# EasyEDA Pro project nrf24l01.eprj

# Schematic nRF24L01
Create Date: 2024-01-03; Page Name: P1; Project Name: nrf24l01; Schematic Name: nRF24L01; Update Date: 2024-01-03; Company: 嘉立创EDA; Page Size: A4; Version: V1.0
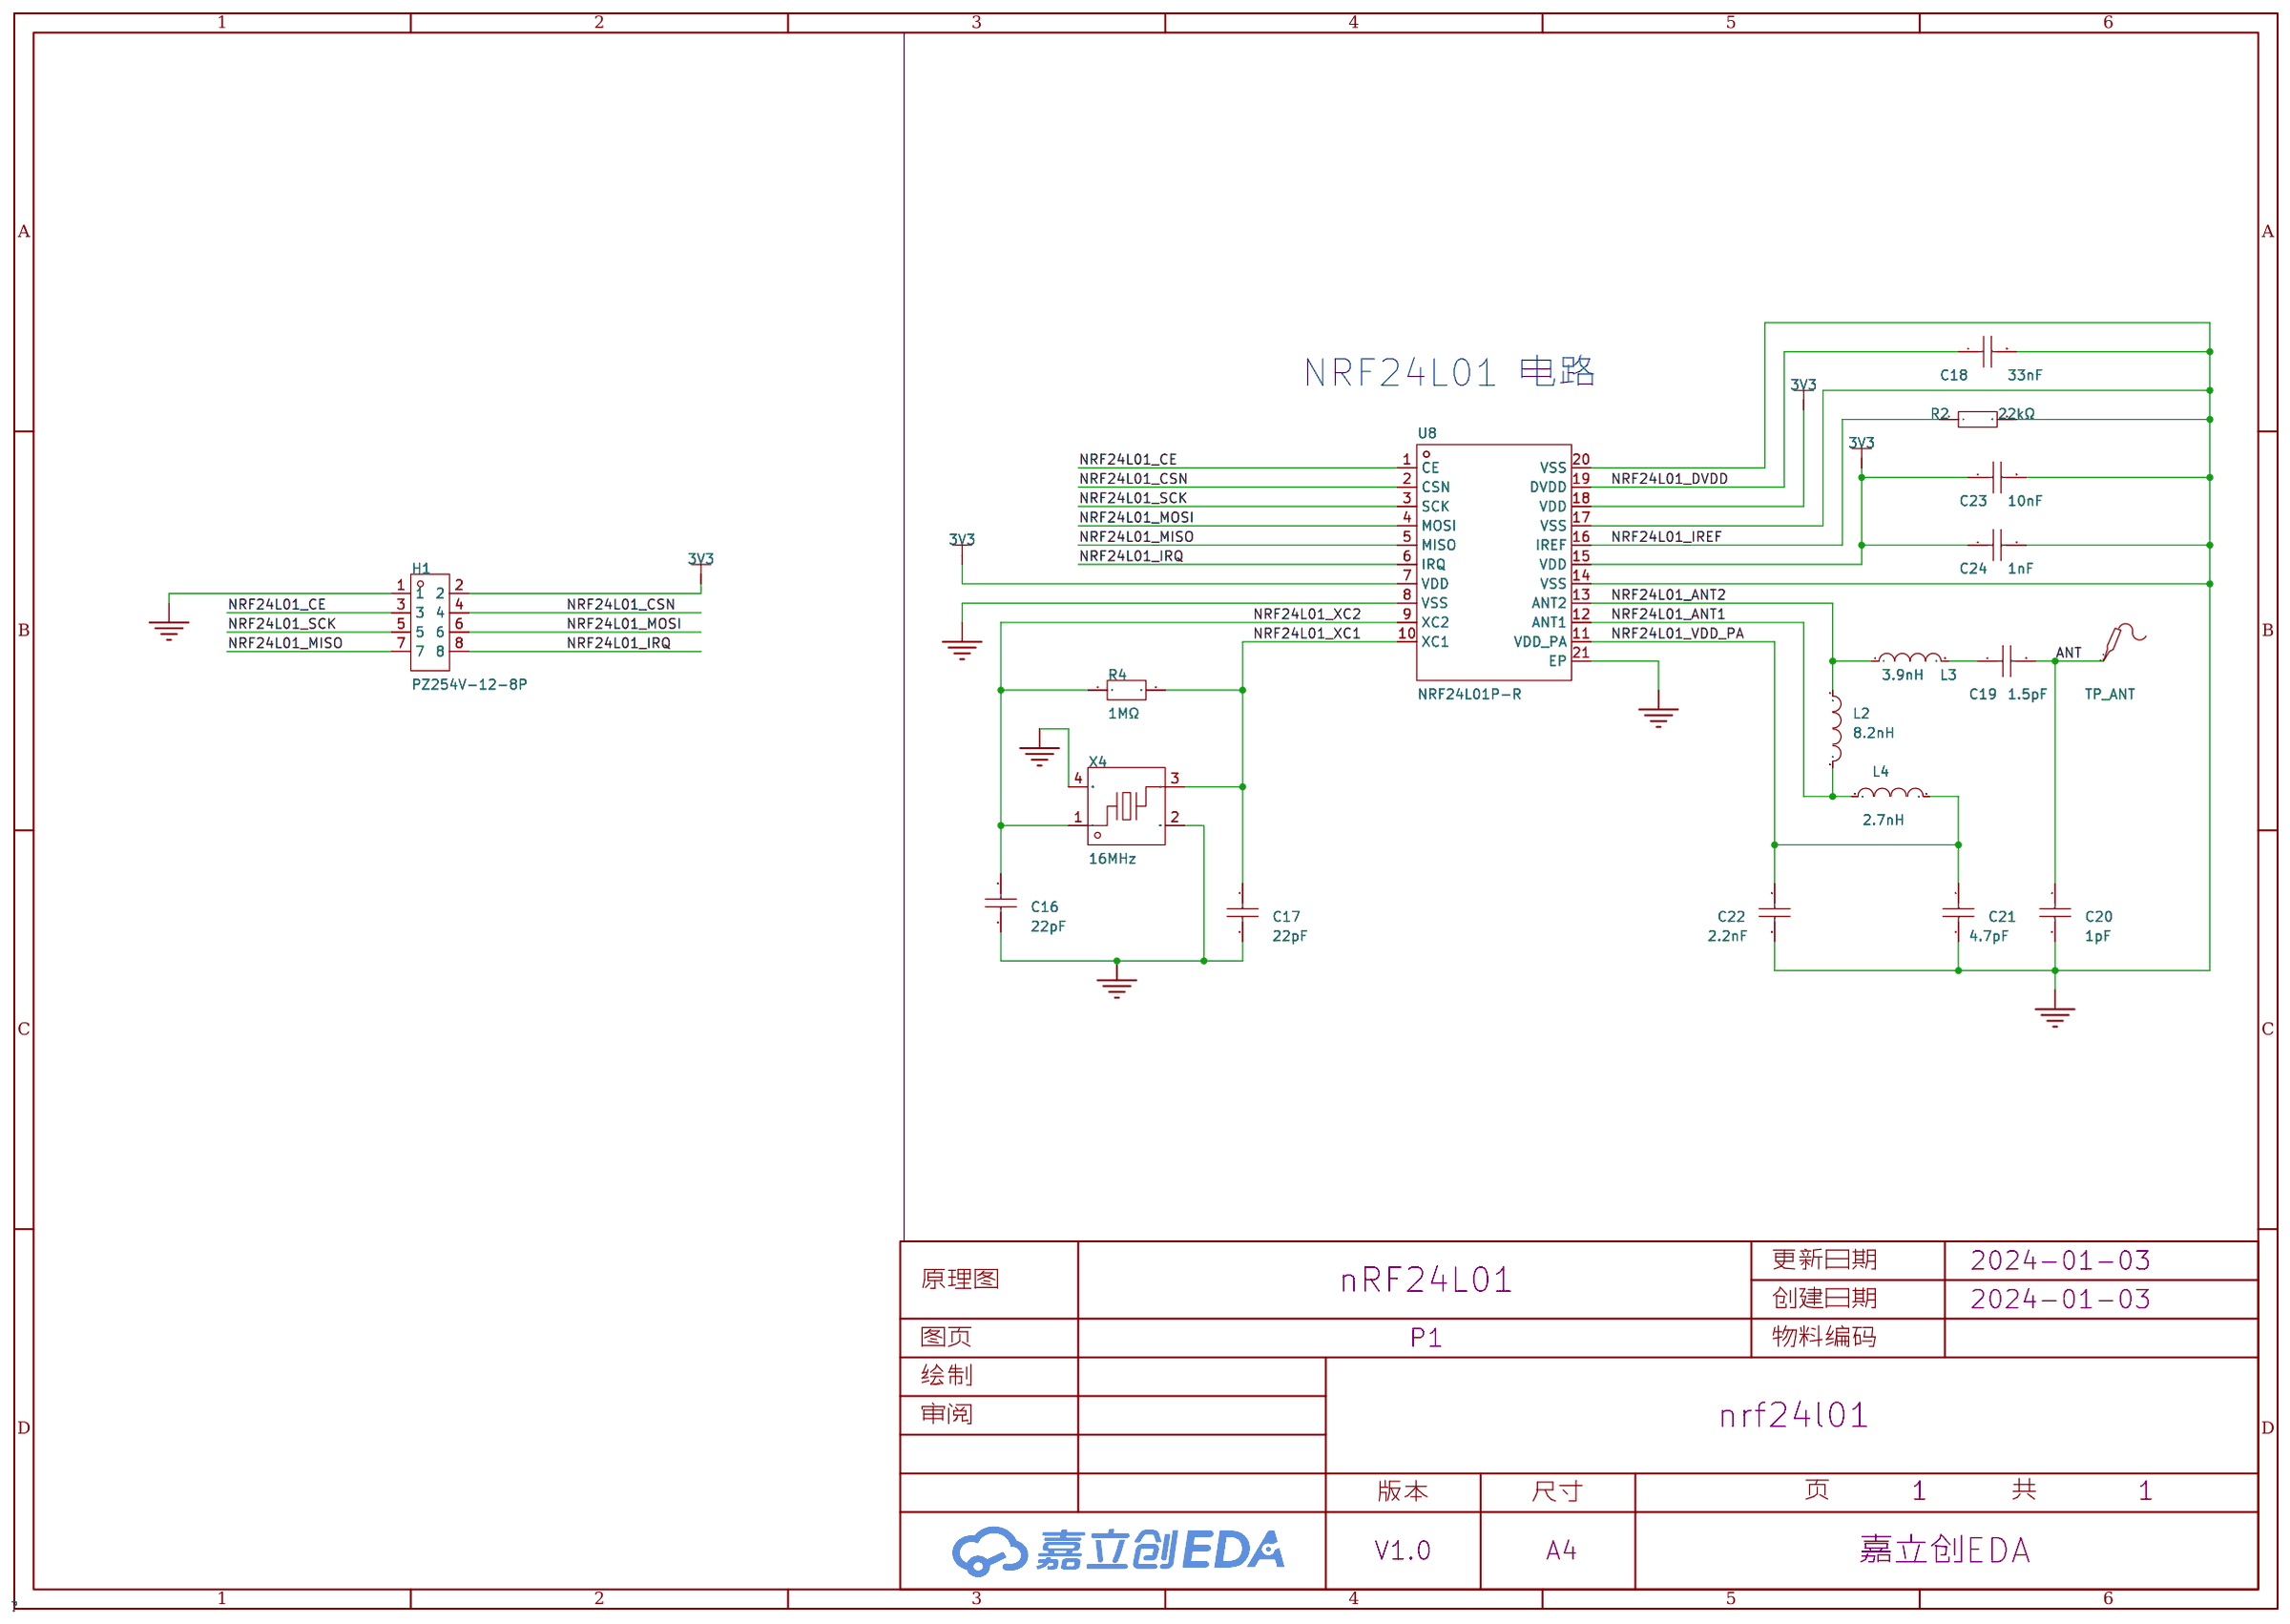
[diagram p0: schematic sheet]

## Parts
C16  22pF  [C0603]
C17  22pF  [C0603]
C18  33nF  [C0603]
C19  1.5pF  [C0603]
C20  1pF  [C0603]
C21  4.7pF  [C0603]
C22  2.2nF  [C0603]
C23  10nF  [C0603]
C24  1nF  [C0603]
H1  PZ254V-12-8P  [HDR-TH_8P-P2.54-V-M-R2-C4-S2.54]
L2  8.2nH  [L0603]
L3  3.9nH  [IND-SMD_L1.6-W0.8-1]
L4  2.7nH  [L0603]
R2  22kΩ  [R0603]
R4  1MΩ  [R0603]
TP_ANT  -  [Test-Point-0.5mm]
U8  NRF24L01P-R  [QFN-20_L4.0-W4.0-P0.50-BL-EP]
X4  16MHz  [CRYSTAL-SMD_4P-L2.0-W1.6-BL]

## Library data of the parts
C16 C17 = CC0603JRNPO9BN220: 容值:22pF;精度:±5%;额定电压:50V;材质(温度系数):NP0;; LCSC Part Name: 22pF ±5% 50V; Supplier Part: C105620; Manufacturer: YAGEO(国巨); Supplier Footprint: 0603; JLCPCB Part Class: 扩展库; Datasheet: https://atta.szlcsc.com/upload/public/pdf/source/20170505/1493957838062.pdf; Supplier: LCSC; Tolerance: ±5%; Voltage Rated: 50V; Temperature Coefficient: NP0
C18 = CL10B333KB8NNNC: 容值:33nF;精度:±10%;额定电压:50V;材质(温度系数):X7R;; LCSC Part Name: 33nF ±10% 50V; Supplier Part: C21117; Manufacturer: SAMSUNG(三星); Supplier Footprint: 0603; JLCPCB Part Class: 基础库; Datasheet: https://atta.szlcsc.com/upload/public/pdf/source/20160218/1457707763339.pdf; Supplier: LCSC; Tolerance: ±10%; Voltage Rated: 50V; Temperature Coefficient: X7R
C19 = 0603CG1R5C500NT: 容值:1.5pF;额定电压:50V;材质(温度系数):C0G;; LCSC Part Name: 1.5pF 50V; Supplier Part: C1639; Manufacturer: FH(风华); Supplier Footprint: 0603; JLCPCB Part Class: 扩展库; Datasheet: https://atta.szlcsc.com/upload/public/pdf/source/20200305/C486355_26A10D38EF8C2A5C37091D0039909270.pdf; Supplier: LCSC; Voltage Rated: 50V; Temperature Coefficient: C0G
C20 = 0603CG1R0C500NT: 容值:1pF;额定电压:50V;材质(温度系数):C0G;; LCSC Part Name: 1pF 50V; Supplier Part: C37117; Manufacturer: FH(风华); Supplier Footprint: 0603; JLCPCB Part Class: 扩展库; Datasheet: https://atta.szlcsc.com/upload/public/pdf/source/20200305/C486355_26A10D38EF8C2A5C37091D0039909270.pdf; Supplier: LCSC; Voltage Rated: 50V; Temperature Coefficient: C0G
C21 = 0603CG4R7C500NT: 容值:4.7pF;额定电压:50V;材质(温度系数):C0G;; LCSC Part Name: 4.7pF 50V; Supplier Part: C1669; Manufacturer: FH(风华); Supplier Footprint: 0603; JLCPCB Part Class: 扩展库; Datasheet: https://atta.szlcsc.com/upload/public/pdf/source/20200305/C486355_26A10D38EF8C2A5C37091D0039909270.pdf; Supplier: LCSC; Voltage Rated: 50V; Temperature Coefficient: C0G
C22 = 0603B222K500NT: 容值:2.2nF;精度:±10%;额定电压:50V;材质(温度系数):X7R;; LCSC Part Name: 2.2nF ±10% 50V; Supplier Part: C1604; Manufacturer: FH(风华); Supplier Footprint: 0603; JLCPCB Part Class: 基础库; Datasheet: https://atta.szlcsc.com/upload/public/pdf/source/20200305/C486355_26A10D38EF8C2A5C37091D0039909270.pdf; Supplier: LCSC; Tolerance: ±10%; Voltage Rated: 50V; Temperature Coefficient: X7R
C23 = CC0603KRX7R9BB103: 容值:10nF;精度:±10%;额定电压:50V;材质(温度系数):X7R;; LCSC Part Name: 10nF ±10% 50V; Supplier Part: C100042; Manufacturer: YAGEO(国巨); Supplier Footprint: 0603; JLCPCB Part Class: 扩展库; Datasheet: https://atta.szlcsc.com/upload/public/pdf/source/20181008/C309510_22F155564471FAF6A489F7D68F34234E.pdf; Supplier: LCSC; Tolerance: ±10%; Voltage Rated: 50V; Temperature Coefficient: X7R
C24 = CC0603KRX7R9BB102: 容值:1nF;精度:±10%;额定电压:50V;材质(温度系数):X7R;; LCSC Part Name: 1nF ±10% 50V; Supplier Part: C100040; Manufacturer: YAGEO(国巨); Supplier Footprint: 0603; JLCPCB Part Class: 扩展库; Datasheet: https://atta.szlcsc.com/upload/public/pdf/source/20180910/C282072_33301C7F631E79921B82A8DAC6BCC5B3.pdf; Supplier: LCSC; Tolerance: ±10%; Voltage Rated: 50V; Temperature Coefficient: X7R
H1 = PZ254V-12-8P: 插针结构:2x4P;间距:2.54mm;行距:2.54mm;圆针/方针:方针;安装类型:直插;排数:双排;总PIN位数:8P;额定电流:-;额定电压:-;配合针长度:6mm;塑高:2.5mm;端接针长度:3mm;触头材质:黄铜;触头镀层:-;工作温度范围:-40℃~+105℃;颜色:黑色;; LCSC Part Name: 间距:2.54mm 2x4P 直插 方针; Supplier Part: C492421; Manufacturer: XFCN(兴飞); Supplier Footprint: 插件,P=2.54mm; JLCPCB Part Class: 扩展库; Datasheet: https://atta.szlcsc.com/upload/public/pdf/source/20200309/C492421_DC8A206AF99CD7755BD4A5B0BC48200B.pdf; Supplier: LCSC; Pin Structure: 2x4P; Pitch: 2.54mm; Row Spacing: 2.54mm; Circluar Pins/Square Pins: 方针; Mounting Type: 直插; Number of Rows: 双排; Number of Pins: 8P; Length of Mating Pin: 6mm; Insulation Height: 2.5mm; Length of End Connection Pin: 3mm; Contact Material: 黄铜; Operating Temperature Range: -40℃~+105℃; Color: 黑色
L2 = VHF160808H8N2JT: 电感值:8.2nH;精度:±5%;额定电流:400mA;饱和电流(Isat):-;直流电阻(DCR):350mΩ;; LCSC Part Name: 8.2nH ±5%; Supplier Part: C90204; Manufacturer: FH(风华); Supplier Footprint: 0603; JLCPCB Part Class: 扩展库; Datasheet: https://atta.szlcsc.com/upload/public/pdf/source/20230223/8EF545BE87E825DABED9AF3380ABCE94.pdf; Supplier: LCSC; Tolerance: ±5%; Rated Current: 400mA; DC Resistance (DCR): 350mΩ
L3 = LQW18AN3N9C10D: 电感值:3.9nH;额定电流:1A;饱和电流(Isat):-;; Supplier Part: C521237; Manufacturer: muRata(村田); Supplier Footprint: 0603; JLCPCB Part Class: 扩展库; Datasheet: https://atta.szlcsc.com/upload/public/pdf/source/20181211/C341790_D709A266A9D251194E0E402A9D974B33.pdf; Supplier: LCSC; Rated Current: 1A; DC Resistance (DCR): 32mΩ
L4 = SCC1608C2N7SSP: 电感值:2.7nH;额定电流:500mA;饱和电流(Isat):-;直流电阻(DCR):200mΩ;; Supplier Part: C412027; Manufacturer: Sunltech(韩国顺磁); Supplier Footprint: 0603; JLCPCB Part Class: 扩展库; Datasheet: https://atta.szlcsc.com/upload/public/pdf/source/20190819/C412052_7E47CA9107AD18C13168C896A90007C8.pdf; Supplier: LCSC; Rated Current: 500mA; DC Resistance (DCR): 200mΩ
R2 = 0603WAF2202T5E: 电阻类型:厚膜电阻;阻值:22kΩ;精度:±1%;功率:100mW;最大工作电压:75V;温度系数:±100ppm/℃;; LCSC Part Name: 22kΩ ±1% 100mW 厚膜电阻; Supplier Part: C31850; Manufacturer: UNI-ROYAL(厚声); Supplier Footprint: 0603; JLCPCB Part Class: 基础库; Datasheet: https://atta.szlcsc.com/upload/public/pdf/source/20200306/C422600_1E6D84923E4A46A82E41ADD87F860B5C.pdf; Supplier: LCSC; Type: 厚膜电阻; Tolerance: ±1%; Power(Watts): 100mW; Overload Voltage (Max): 75V; Temperature Coefficient: ±100ppm/℃; Operating Temperature Range: -55℃~+155℃
R4 = SC0603F1004F2BNRH: 阻值:1MΩ;精度:±1%;功率:-;温度系数:±100ppm/℃;; LCSC Part Name: 1MΩ ±1%; Supplier Part: C3152128; Manufacturer: Sunway(信维通信); Supplier Footprint: 0603; JLCPCB Part Class: 扩展库; Datasheet: https://atta.szlcsc.com/upload/public/pdf/source/20220728/FFCE43BB6DF8FA16AEE331F0F4B289DE.pdf; Supplier: LCSC; Tolerance: ±1%; Temperature Coefficient: ±100ppm/℃
TP_ANT = Test-Point: Test Point 测试点
U8 = NRF24L01P-R: 频率范围:2.4GHz;接口:SPI;应用领域:通用 ISM>1GHz;数据速率:2Mbps;灵敏度:-94dBm;典型应用频率:2.4GHz;; LCSC Part Name: 单芯片2.4GHz收发器; Supplier Part: C8791; Manufacturer: NORDIC; Supplier Footprint: QFN-20-EP(4x4); JLCPCB Part Class: 扩展库; Datasheet: https://atta.szlcsc.com/upload/public/pdf/source/20120816/1457706530106.pdf; Supplier: LCSC; Frequency Range: 2.4GHz; Interface: SPI; Operating Voltage: 1.9V~3.6V; Applications: 通用 ISM>1GHz; Output Power: 0dBm; Data Rate: 2Mbps; Current Of Transmitting: 7mA; Sensitivity: -94dBm; Receive Current: 12.6mA; Typical Application Frequency: 2.4GHz; Operating Temperature: -40℃~+85℃
X4 = XL7EL89COI-111YLC-16M: 晶振类型:贴片晶振;频率:16MHz;常温频差:±10ppm;外接负载电容:12pF;频率稳定度(全温):±20ppm;; LCSC Part Name: 16MHz ±10ppm 12pF; Supplier Part: C2965579; Manufacturer: YXC(扬兴晶振); Supplier Footprint: SMD2016-4P; JLCPCB Part Class: 扩展库; Datasheet: https://atta.szlcsc.com/upload/public/pdf/source/20220121/6B4B3E7EF7974858943D806BF8CACEA3.pdf; Supplier: LCSC; Crystal Type: 贴片晶振; Normal temperature Frequency Tolerance: ±10ppm; External load capacitor: 12pF; Frequency Stability(Full temperature range): ±20ppm; Operating Temperature: -40℃~+85℃

## Nets
3V3: C23.1 C24.1 H1.2 U8.7(VDD) U8.15(VDD) U8.18(VDD)
GND: C16.2 C17.2 C18.2 C20.2 C21.2 C22.2 C23.2 C24.2 H1.1 R2.2 U8.8(VSS) U8.14(VSS) U8.17(VSS) U8.20(VSS) U8.21(EP) X4.2(GND) X4.4(GND)
ANT: C19.2 C20.1 TP_ANT.1
NRF24L01_ANT1: L2.2 L4.1 U8.12(ANT1)
NRF24L01_ANT2: L2.1 L3.1 U8.13(ANT2)
NRF24L01_CE: H1.3 U8.1(CE)
NRF24L01_CSN: H1.4 U8.2(CSN)
NRF24L01_DVDD: C18.1 U8.19(DVDD)
NRF24L01_IREF: R2.1 U8.16(IREF)
NRF24L01_IRQ: H1.8 U8.6(IRQ)
NRF24L01_MISO: H1.7 U8.5(MISO)
NRF24L01_MOSI: H1.6 U8.4(MOSI)
NRF24L01_SCK: H1.5 U8.3(SCK)
NRF24L01_VDD_PA: C21.1 C22.1 L4.2 U8.11(VDD_PA)
NRF24L01_XC1: C17.1 R4.2 U8.10(XC1) X4.3
NRF24L01_XC2: C16.1 R4.1 U8.9(XC2) X4.1
$1N798: C19.1 L3.2

## Notes on the sheet
- NRF24L01 电路

# Schematic Ci24R1
Create Date: 2024-01-03; Page Name: P1; Project Name: nrf24l01; Schematic Name: Ci24R1; Update Date: 2024-01-03; Company: 嘉立创EDA; Page Size: A4; Version: V1.0
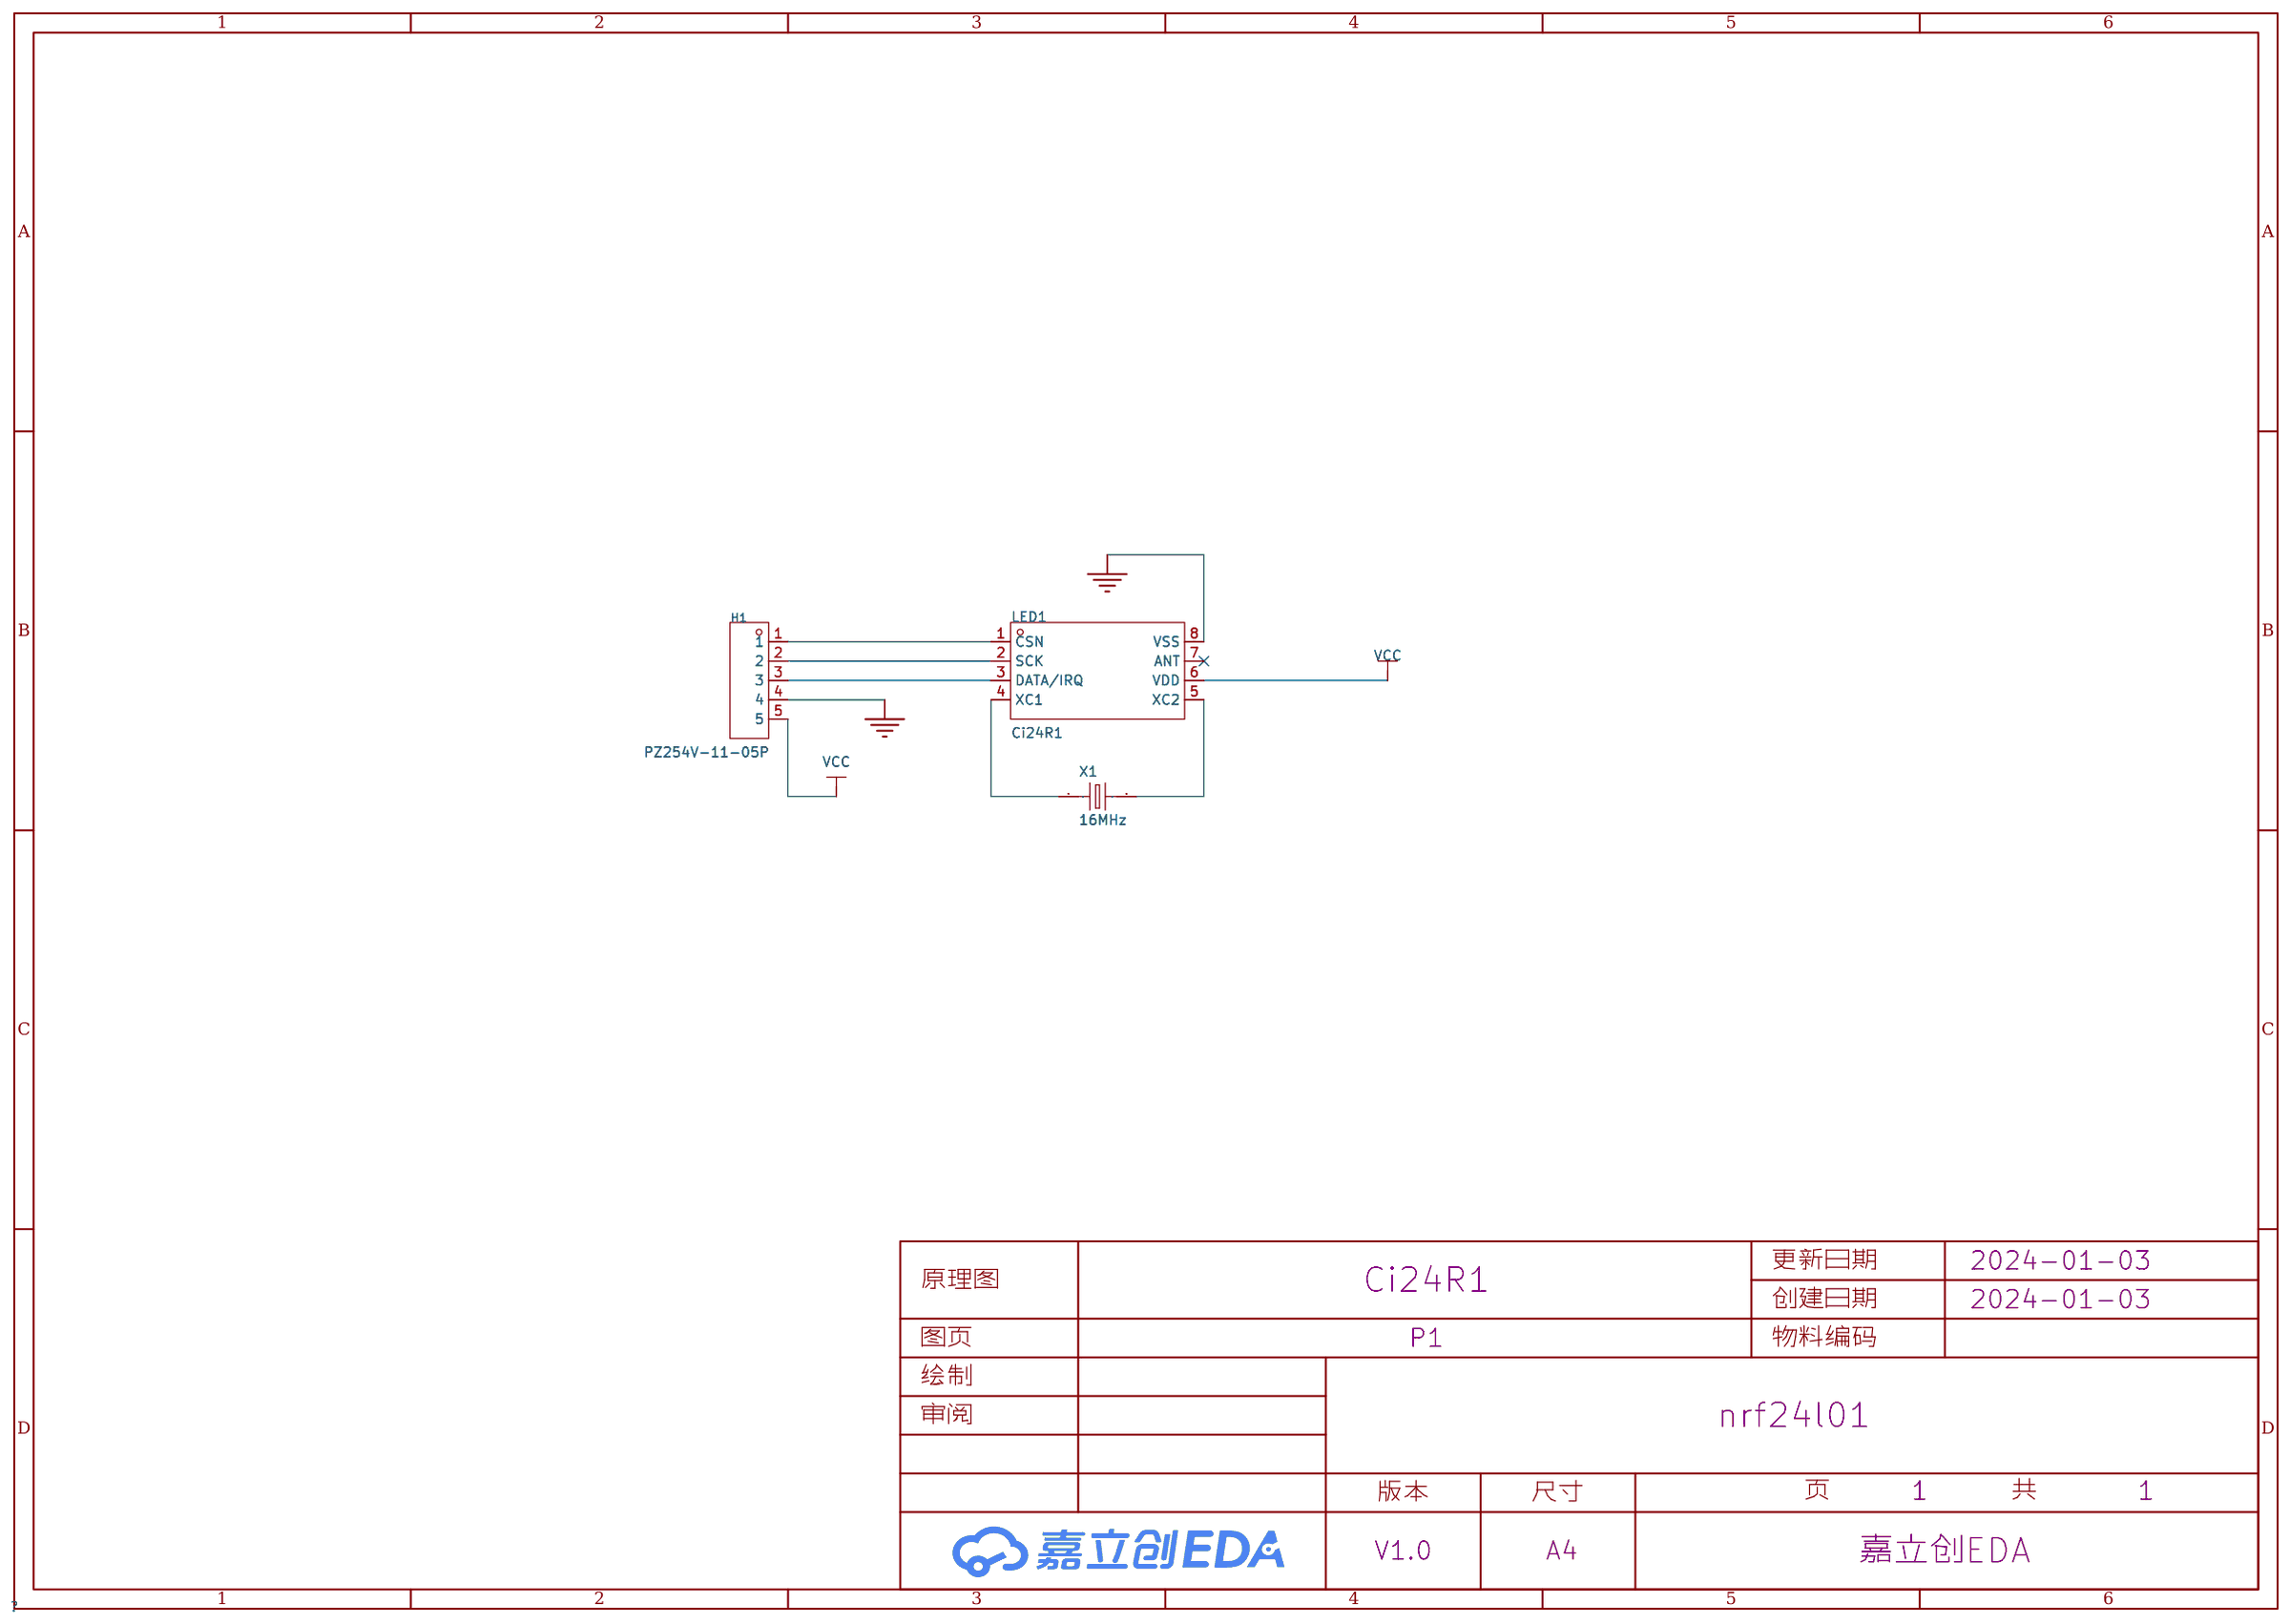
[diagram p1: schematic sheet]

## Parts
H1  PZ254V-11-05P  [HDR-TH_5P-P2.54-V-M]
LED1  Ci24R1  [SOIC-8_L4.9-W3.9-P1.27-LS6.0-BL]
X1  16MHz  [HC-49S_L11.4-W4.8]

## Library data of the parts
H1 = PZ254V-11-05P: 排数:单排;总PIN位数:5P;间距:2.54mm;插针结构:1x5P;行距:-;安装类型:直插;圆针/方针:方针;额定电流:-;额定电压:-;配合针长度:6mm;塑高:2.5mm;端接针长度:3mm;触头材质:黄铜;触头镀层:-;工作温度范围:-40℃~+105℃;颜色:黑色;; LCSC Part Name: 2.54mm 1x5P 直插 方针; Supplier Part: C492404; Manufacturer: XFCN(兴飞); Supplier Footprint: 插件,P=2.54mm; JLCPCB Part Class: 扩展库; Datasheet: https://atta.szlcsc.com/upload/public/pdf/source/20200309/C492404_E51533260F8710EFF5D4617281164C1D.pdf; Supplier: LCSC; Number of Rows: 单排; Number of Pins: 5P; Pitch: 2.54mm; Pin Structure: 1x5P; Mounting Type: 直插; Circluar Pins/Square Pins: 方针; Length of Mating Pin: 6mm; Insulation Height: 2.5mm; Length of End Connection Pin: 3mm; Contact Material: 黄铜; Operating Temperature Range: -40℃~+105℃; Color: 黑色
LED1 = Ci24R1: 频率范围:2.4GHz~2.525GHz;接口:SPI;应用领域:ISM;数据速率:2Mbps;灵敏度:-80dBm;典型应用频率:2.4GHz;; LCSC Part Name: 超低成本高性能2.4GHz GFSK 无线收发芯片; Supplier Part: C2909832; Manufacturer: 南京中科微; Supplier Footprint: SOIC-8; JLCPCB Part Class: 扩展库; Datasheet: https://atta.szlcsc.com/upload/public/pdf/source/20211213/ED223685FD9546303E3CE2DB911B1F80.pdf; Supplier: LCSC; Frequency Range: 2.4GHz~2.525GHz; Interface: SPI; Operating Voltage: 2.1V~3.6V; Applications: ISM; Output Power: 11dBm; Data Rate: 2Mbps; Current Of Transmitting: 18mA; Sensitivity: -80dBm; Receive Current: 20mA; Typical Application Frequency: 2.4GHz; Operating Temperature: -40℃~+125℃
X1 = TAXM16M2GLFBET2T: 晶振类型:49SMD晶振;频率:16MHz;常温频差:±30ppm;负载电容:20pF;频率稳定度(全温):±30ppm;; LCSC Part Name: 16MHz ±30ppm 20pF; Supplier Part: C111377; Manufacturer: YJX(雅晶鑫); Supplier Footprint: HC-49S-SMD; JLCPCB Part Class: 扩展库; Datasheet: https://atta.szlcsc.com/upload/public/pdf/source/20190305/C362352_AFD953984E9CF948957766F91AB56AA4.pdf; Supplier: LCSC; Crystal Type: 49SMD晶振; Normal temperature Frequency Tolerance: ±30ppm; Load Capacitance: 20pF; Frequency Stability(Full temperature range): ±30ppm; Equivalent Series Resistance (ESR): 50Ω; Operating Temperature: -20℃~+70℃

## Nets
GND: H1.4 LED1.8(VSS)
VCC: H1.5 LED1.6(VDD)
$1N229: LED1.4(XC1) X1.1
$1N233: LED1.5(XC2) X1.2
$1N417: H1.1 LED1.1(CSN)
$1N423: H1.2 LED1.2(SCK)
$1N426: H1.3 LED1.3(DATA/IRQ)

Not connected (* = marked no-connect by the designer): LED1 7(ANT)*

# Board nRF24L01
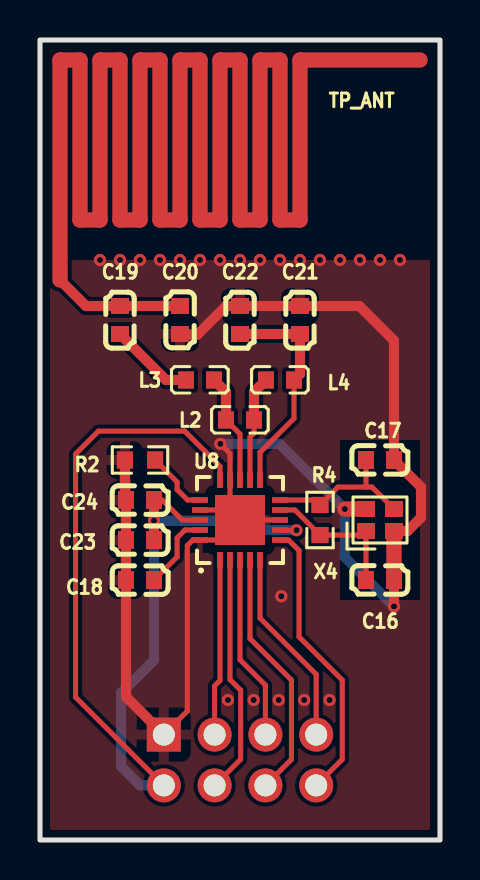
[diagram p2: board, top side]
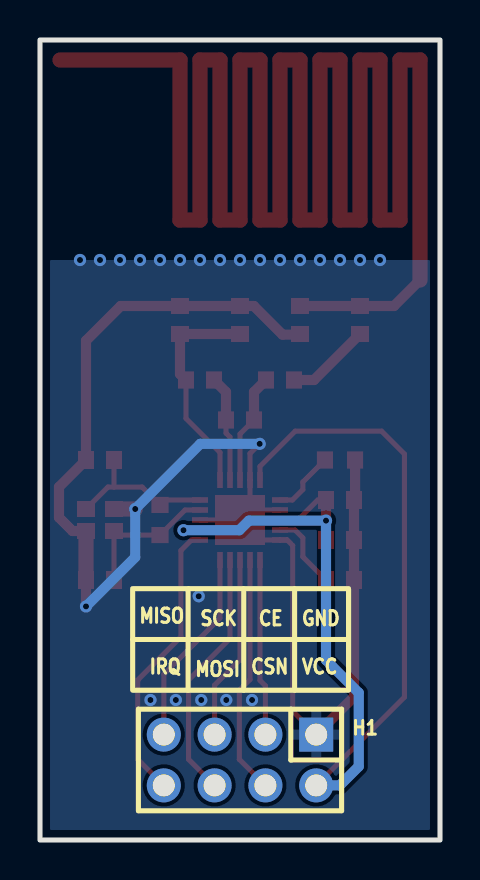
[diagram p3: board, bottom side, seen from below]

Outline 20 x 40 mm; copper layers: Top Layer, Bottom Layer. Coordinates in mm from the lower left corner of the outline.
Outline path: rectangle 0,40 20,0
Stack: Top Layer 0.035mm / Dielectric1 1.51mm FR4 er 4.5 / Bottom Layer 0.035mm

## Design rules (mm)
template: JLCPCB Capability(Two Layers Board)
spacing copperThickness1oz (default): track to track 0.102, other pairs 0.152 to 0.3
spacing copperThickness2oz: track to track 0.203, other pairs 0.152 to 0.3
track width copperThickness1oz (default): min 0.127, default 0.254, max 2.54
track width copperThickness2oz: min 0.203, default 0.254, max 2.54
differential pair differentialPair (default): width min 0.127, default 0.254, max 2.54; gap min 0.152, default 0.152
via viaSize (default): diameter min 0.5, default 0.61, max 10; hole min 0.3, default 0.305, max 6.3

## Placement (name value [footprint] x y rotation side)
C16  22pF  [C0603]  17 13 0 top
C17  22pF  [C0603]  17 19 0 top
C18  33nF  [C0603]  5 13 180 top
C19  1.5pF  [C0603]  4 26 90 top
C20  1pF  [C0603]  7 26 270 top
C21  4.7pF  [C0603]  13 26 90 top
C22  2.2nF  [C0603]  10 26 90 top
C23  10nF  [C0603]  5 15 180 top
C24  1nF  [C0603]  5 17 180 top
H1  PZ254V-12-8P  [HDR-TH_8P-P2.54-V-M-R2-C4-S2.54]  10 4 0 bottom
L2  8.2nH  [L0603]  10 21 0 top
L3  3.9nH  [IND-SMD_L1.6-W0.8-1]  8 23 0 top
L4  2.7nH  [L0603]  12 23 0 top
R2  22kΩ  [R0603]  5 19 180 top
R4  1MΩ  [R0603]  14 16 90 top
TP_ANT  -  [Test-Point-0.5mm]  19 39 0 top
U8  NRF24L01P-R  [QFN-20_L4.0-W4.0-P0.50-BL-EP]  10 16 0 top
X4  16MHz  [CRYSTAL-SMD_4P-L2.0-W1.6-BL]  17 16 0 top

## Footprints (pads in the part's own frame, mm; a bottom-side part is the same pattern mirrored in y, then rotated)
C0603
  rect 0.8x0.9 smd: 1(-0.7,0) 2(0.7,0)
CRYSTAL-SMD_4P-L2.0-W1.6-BL
  rect 0.9x0.8 smd: 1(-0.7,-0.55) 2(0.7,-0.55) 3(0.7,0.55) 4(-0.7,0.55)
HDR-TH_8P-P2.54-V-M-R2-C4-S2.54
  rect 1.7x1.7 hole 1.1: 1(-3.81,-1.27)
  round 1.7 hole 1.1: 2(-3.81,1.27) 3(-1.27,-1.27) 4(-1.27,1.27) 5(1.27,-1.27) 6(1.27,1.27) 7(3.81,-1.27) 8(3.81,1.27)
IND-SMD_L1.6-W0.8-1
  rect 0.8x0.864 smd: 1(0.7,0) 2(-0.7,0)
L0603
  rect 0.8x0.864 smd: 1(-0.7,0) 2(0.7,0)
QFN-20_L4.0-W4.0-P0.50-BL-EP
  rect 0.28x0.8 smd: 1(-1,-2) 2(-0.5,-2) 3(0,-2) 4(0.5,-2) 5(1,-2) 11(1,2) 12(0.5,2) 13(0,2) 14(-0.5,2) 15(-1,2)
  rect 0.8x0.28 smd: 6(2,-1) 7(2,-0.5) 8(2,0) 9(2,0.5) 10(2,1) 16(-2,1) 17(-2,0.5) 18(-2,0) 19(-2,-0.5) 20(-2,-1)
  rect 2.5x2.5 smd: 21(0,0)
R0603
  rect 0.806x0.864 smd: 1(-0.753,0) 2(0.753,0)
Test-Point-0.5mm
  round 0.5 smd: 1(0,0)

## Nets
As in the schematic.

## Via types
v1: diameter 0.61, hole 0.305, Top Layer to Bottom Layer, 27 vias

## Routing (per net, layer and track width the routed paths; a pad name or vN(x,y) marks a point on that pad's centre or on a via; arc(x,y) is an arc through that point)
3V3: length 55.9
  Top Layer w0.254: C24.1 6.11,17 7.11,16 8,16 U8.18 ; H1.2 1.78,7.14 1.78,19.3 2.92,20.44 7.24,20.44 9,18.68 U8.15 ; v1(12.83,15.49) 12.01,15.49 U8.7
  Top Layer w0.508: C24.1 v1(5.7,15.97) C23.1
  Bottom Layer w0.508: v1(12.83,15.49) 10.03,15.49 9.55,15.97 v1(5.7,15.97) 5.7,9 4.06,7.36 4.06,3.68 5.01,2.73 H1.2
GND: length 76.7
  Top Layer w0.254: U8.21 9,15 U8.20 7.64,15 7.37,14.72 7.37,6.45 H1.1 ; U8.21 U8.8 ; U8.21 9.5,16.5 ; v1(9.02,19.81) 9.5,19.32 U8.14 9.5,16.5 ; 9.5,16.5 U8.17
  Top Layer w0.508: H1.1 4.3,7.16 C18.2 C23.2 C24.2 4.25,17.05 R2.2 ; C20.2 7.03,25.27 7.87,25.27 9.31,26.7 C22.2 C21.2 15.97,26.7 17.7,24.97 C17.2 19.05,17.65 19.05,16.12 18.38,15.45 X4.2 ; C16.2 v1(17.7,11.68)
  Top Layer w0.762: X4.2 C16.2 ; X4.4 v1(15.24,16.55)
  Bottom Layer w0.508: v1(17.7,11.68) 15.24,14.14 v1(15.24,16.55) 11.98,19.81 v1(9.02,19.81)
  vias: v1(3,29) v1(4,29) v1(5,29) v1(6,29) v1(7,29) v1(8,29) v1(9,29) v1(9.4,7) v1(10,29) v1(10.69,7) v1(11,29) v1(11.94,7) v1(12,29) v1(12.06,12.19) v1(13,29) v1(13.21,7) v1(14,29) v1(14.48,7) v1(15,29) v1(16,29) v1(17,29) v1(18,29)
ANT: length 131.5
  Top Layer w0.508: 1,28 2.3,26.7 C19.2 C20.1
  Top Layer w0.762: TP_ANT.1 13,39 13,31 12,31 12,39 11,39 11,31 10,31 10,39 9,39 9,31 8,31 8,39 7,39 7,31 6,31 6,39 5,39 5,31 4,31 4,39 3,39 3,31 2,31 2,39 1,39 1,28
NRF24L01_ANT1: length 5.3
  Top Layer w0.254: U8.12 10.5,20.15 10.7,20.35 L2.2
  Top Layer w0.508: L2.2 10.7,22.4 L4.1
NRF24L01_ANT2: length 5.5
  Top Layer w0.254: L2.1 10,20.3 U8.13
  Top Layer w0.508: L2.1 9.3,22.4 L3.1
NRF24L01_CE: length 8.8
  Top Layer w0.254: U8.1 9,7.98 8.73,7.71 H1.3
NRF24L01_CSN: length 12
  Top Layer w0.254: U8.2 9.5,8.02 10.03,7.49 10.03,4.03 H1.4
NRF24L01_DVDD: length 3.9
  Top Layer w0.254: U8.19 7.25,15.5 6.86,15.11 6.86,14.16 C18.1
NRF24L01_IREF: length 3.3
  Top Layer w0.254: U8.16 7.38,17 6.86,17.52 6.86,17.9 R2.1
NRF24L01_IRQ: length 14.3
  Top Layer w0.254: U8.6 12.43,15 12.95,14.47 12.95,10.16 15.11,8 15.11,4.03 H1.8
NRF24L01_MISO: length 9.9
  Top Layer w0.254: H1.7 13.81,8.28 11,11.09 U8.5
NRF24L01_MOSI: length 12.7
  Top Layer w0.254: U8.4 10.5,10.07 12.57,8 12.57,4.03 H1.6
NRF24L01_SCK: length 9.3
  Top Layer w0.254: U8.3 10,9.01 11.27,7.74 H1.5
NRF24L01_VDD_PA: length 11.1
  Top Layer w0.254: U8.11 11,19.38 12.7,21.08 L4.2
  Top Layer w0.508: L4.2 13,23.3 C21.1 C22.1
NRF24L01_XC1: length 8
  Top Layer w0.254: 16.3,17.65 14.89,17.65 R4.2 13.75,17 U8.10 ; 16.3,17.65 16.6,17.65 X4.3 ; 16.3,17.65 C17.1
NRF24L01_XC2: length 7.4
  Top Layer w0.254: C16.1 X4.1 16.1,15.25 R4.1 12.75,16.5 U8.9
$1N798: length 4.3
  Top Layer w0.508: L3.2 6.3,23 C19.1

## Copper pours and planes (outline as drawn; the poured copper is in the pictures)
GND on Top Layer: 0,29 20,29 20,0 0,0
GND on Bottom Layer: 0,29 20,29 20,0 0,0

## Text on the board
Bottom Silkscreen Layer: GND | VCC | CE | CSN | SCK | MOSI | IRQ | MISO

# Board Ci24R1
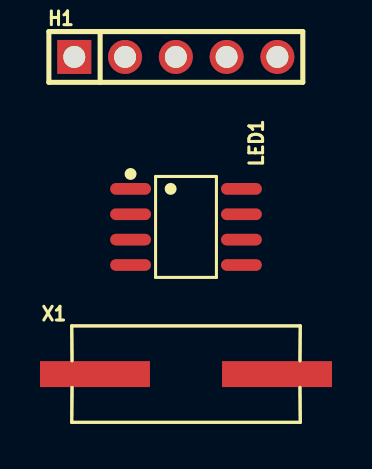
[diagram p4: board, top side]
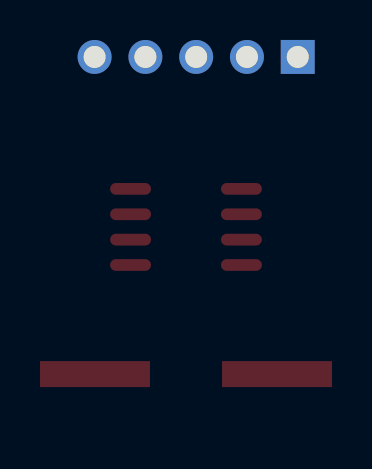
[diagram p5: board, bottom side, seen from below]

No outline. copper layers: Top Layer, Bottom Layer. Coordinates in mm from the lowest, leftmost part position.
Stack: Top Layer 0.035mm / Dielectric1 1.51mm FR4 er 4.5 / Bottom Layer 0.035mm

## Design rules (mm)
template: JLCPCB Capability(Two Layers Board)
spacing copperThickness1oz (default): track to track 0.102, other pairs 0.152 to 0.3
spacing copperThickness2oz: track to track 0.203, other pairs 0.152 to 0.3
track width copperThickness1oz (default): min 0.127, default 0.254, max 2.54
track width copperThickness2oz: min 0.203, default 0.254, max 2.54
differential pair differentialPair (default): width min 0.127, default 0.254, max 2.54; gap min 0.152, default 0.152
via viaSize (default): diameter min 0.5, default 0.61, max 10; hole min 0.3, default 0.305, max 6.3

## Placement (name value [footprint] x y rotation side)
H1  PZ254V-11-05P  [HDR-TH_5P-P2.54-V-M]  0 15.88 0 top
LED1  Ci24R1  [SOIC-8_L4.9-W3.9-P1.27-LS6.0-BL]  0.51 7.37 270 top
X1  16MHz  [HC-49S_L11.4-W4.8]  0.51 0 0 top

## Footprints (pads in the part's own frame, mm; a bottom-side part is the same pattern mirrored in y, then rotated)
HC-49S_L11.4-W4.8
  rect 5.5x1.3 smd: 1(-4.553,0) 2(4.553,0)
HDR-TH_5P-P2.54-V-M
  rect 1.7x1.7 hole 1.1: 1(-5.08,0)
  round 1.7 hole 1.1: 2(-2.54,0) 3(0,0) 4(2.54,0) 5(5.08,0)
SOIC-8_L4.9-W3.9-P1.27-LS6.0-BL
  oval 0.588x2.045 smd: 1(-1.905,-2.772) 2(-0.635,-2.772) 3(0.635,-2.772) 4(1.905,-2.772) 5(1.905,2.772) 6(0.635,2.772) 7(-0.635,2.772) 8(-1.905,2.772)

## Nets
As in the schematic.

Pads without a net: LED1 7
